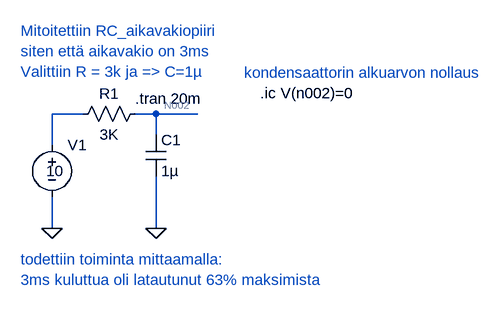
[diagram p0: schematic RC_aikavakiopiiri.asc]
RC_aikavakiopiiri.asc, the LTspice schematic file:
Version 4
SHEET 1 880 680
WIRE 96 112 48 112
WIRE 208 112 176 112
WIRE 272 112 208 112
WIRE 208 144 208 112
WIRE 48 160 48 112
WIRE 48 288 48 240
WIRE 208 288 208 208
FLAG 208 288 0
FLAG 48 288 0
SYMBOL cap 192 144 R0
SYMATTR InstName C1
SYMATTR Value 1µ
SYMBOL res 192 96 R90
WINDOW 0 0 56 VBottom 2
WINDOW 3 32 56 VTop 2
SYMATTR InstName R1
SYMATTR Value 3K
SYMBOL voltage 48 144 R0
WINDOW 3 -9 56 Left 2
WINDOW 123 0 0 Left 2
WINDOW 39 0 0 Left 2
SYMATTR InstName V1
SYMATTR Value 10
TEXT 0 -16 Left 2 ;Mitoitettiin RC_aikavakiopiiri\nsiten että aikavakio on 3ms\nValittiin R = 3k ja => C=1µ
TEXT 176 88 Left 2 !.tran 20m
TEXT 368 80 Left 2 !.ic V(n002)=0
TEXT 0 336 Left 2 ;todettiin toiminta mittaamalla:\n3ms kuluttua oli latautunut 63% maksimista
TEXT 344 48 Left 2 ;kondensaattorin alkuarvon nollaus

The netlist it stands for:
* RC_aikavakiopiiri.asc
C1 N002 0 1µ
R1 N002 N001 3K
V1 N001 0 10
* Mitoitettiin RC_aikavakiopiiri
* siten että aikavakio on 3ms
* Valittiin R = 3k ja => C=1µ
.tran 20m
.ic V(n002)=0
* todettiin toiminta mittaamalla:
* 3ms kuluttua oli latautunut 63% maksimista
* kondensaattorin alkuarvon nollaus
.backanno
.end